# Altium project REMOTER.PrjPCB
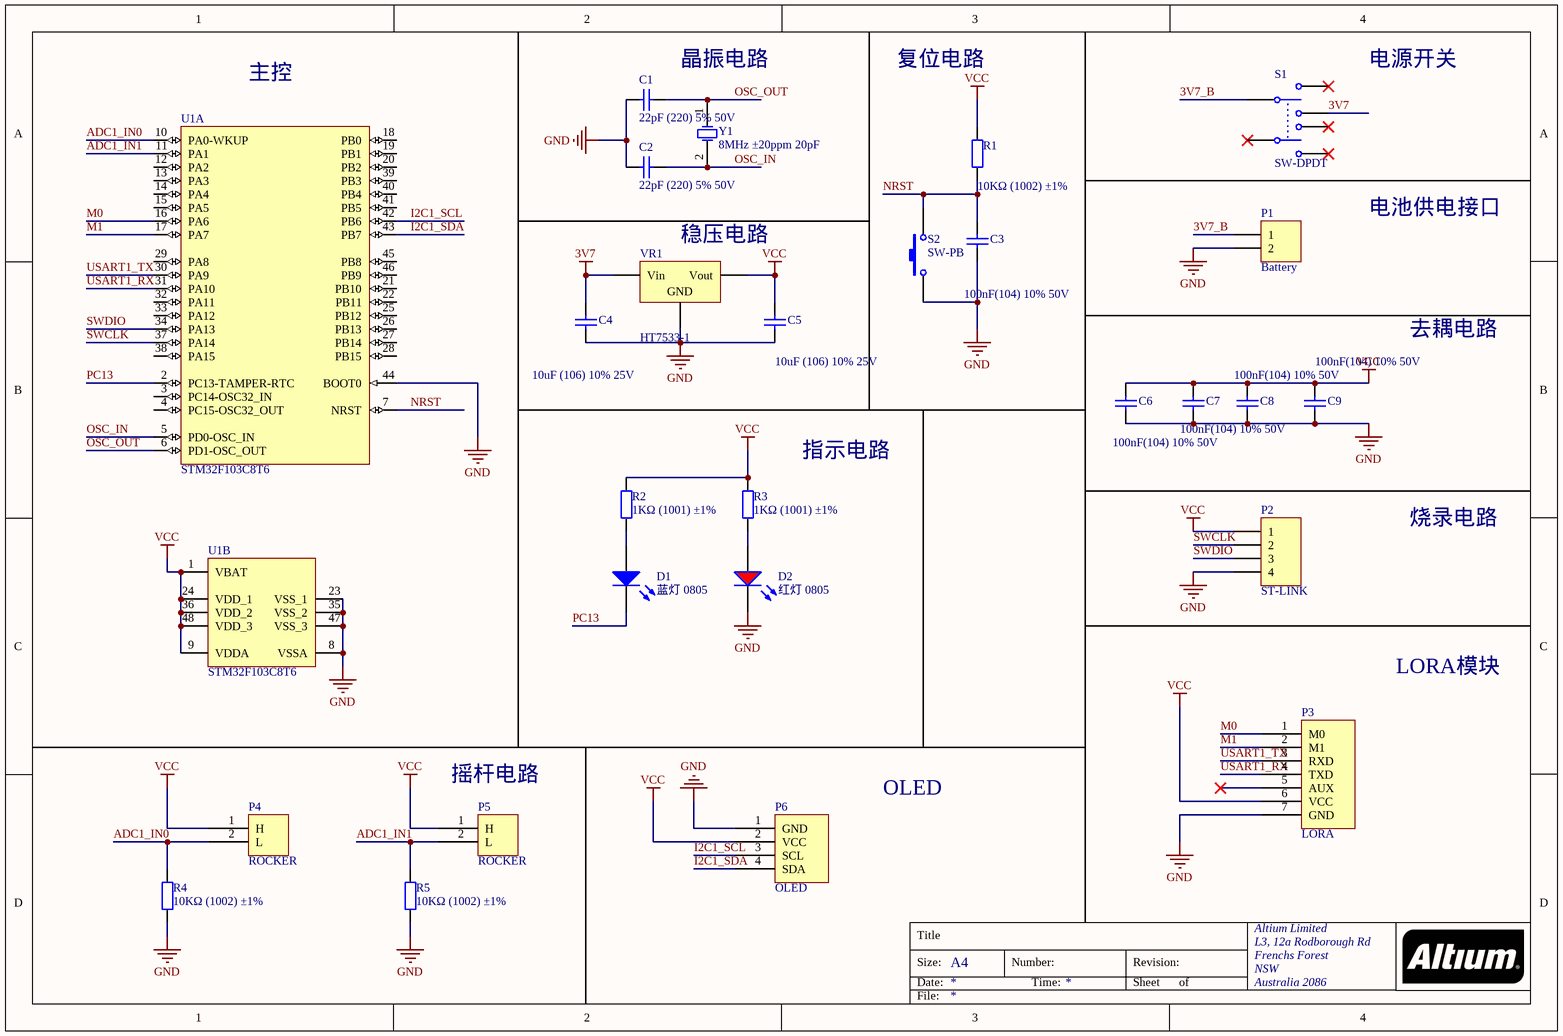
[diagram p0: REMOTER.SchDoc]
1 sheet, 27 parts. Net scope: global (net labels, ports and power ports of the same name join across sheets).
Board file: REMOTER.PcbDoc

## Sheet REMOTER.SchDoc
size A4; Organization: Altium Limited; Address1: L3, 12a Rodborough Rd; Address2: Frenchs Forest; Address3: NSW; Address4: Australia 2086

### Parts
C1  22pF (220) 5% 50V  [0805_C]
C2  22pF (220) 5% 50V  [0805_C]
C3  100nF(104) 10% 50V  [0805_C]
C4  10uF (106) 10% 25V  [0805_C]
C5  10uF (106) 10% 25V  [0805_C]
C6  100nF(104) 10% 50V  [0805_C]
C7  100nF(104) 10% 50V  [0805_C]
C8  100nF(104) 10% 50V  [0805_C]
C9  100nF(104) 10% 50V  [0805_C]
D1  蓝灯 0805  [0805_LED_S1]
D2  红灯 0805  [0805_LED_S1]
P1  Battery  [HDR1X2]
P2  ST-LINK  [HDR1X4]
P3  LORA  [LORA]
P4  ROCKER  [ROCKER]
P5  ROCKER  [ROCKER]
P6  OLED  [OLED]
R1  10KΩ (1002) ±1%  [0805_R]
R2  1KΩ (1001) ±1%  [0805_R]
R3  1KΩ (1001) ±1%  [0805_R]
R4  10KΩ (1002) ±1%  [0805_R]
R5  10KΩ (1002) ±1%  [0805_R]
S1  SW-DPDT  [DPDT-6]
S2  SW-PB  [SPST-2]
U1  STM32F103C8T6  [LQFP-48_7x7x05P]  (parts A,B of 2)
VR1  HT7533-1  [SOT-89(SOT-89-3)]
Y1  8MHz ±20ppm 20pF  [SMD-5032_2P]

### Nets
3V7: C4.2 S1.3 VR1.2(Vin)
GND: C1.1 C2.1 C3.1 C4.1 C5.2 C6.1 C7.1 C8.1 C9.1 D2.K P1.2 P2.4 P3.7(GND) P6.1(GND) R4.1 R5.1 S2.1 U1.8(VSSA) U1.23(VSS_1) U1.35(VSS_2) U1.44(BOOT0) U1.47(VSS_3) VR1.1(GND)
VCC: C5.1 C6.2 C7.2 C8.2 C9.2 P2.1 P3.6(VCC) P4.1(H) P5.1(H) P6.2(VCC) R1.1 R2.1 R3.1 U1.1(VBAT) U1.9(VDDA) U1.24(VDD_1) U1.36(VDD_2) U1.48(VDD_3) VR1.3(Vout)
3V7_B: P1.1 S1.1
ADC1_IN0: P4.2(L) R4.2 U1.10(PA0-WKUP)
ADC1_IN1: P5.2(L) R5.2 U1.11(PA1)
I2C1_SCL: P6.3(SCL) U1.42(PB6)
I2C1_SDA: P6.4(SDA) U1.43(PB7)
M0: P3.1(M0) U1.16(PA6)
M1: P3.2(M1) U1.17(PA7)
NRST: C3.2 R1.2 S2.2 U1.7(NRST)
OSC_IN: C2.2 U1.5(PD0-OSC_IN) Y1.2(OSC2)
OSC_OUT: C1.2 U1.6(PD1-OSC_OUT) Y1.1(OSC1)
PC13: D1.K U1.2(PC13-TAMPER-RTC)
SWCLK: P2.2 U1.37(PA14)
SWDIO: P2.3 U1.34(PA13)
USART1_RX: P3.4(TXD) U1.31(PA10)
USART1_TX: P3.3(RXD) U1.30(PA9)
NetD1_A: D1.A R2.2
NetD2_A: D2.A R3.2

Not connected (* = marked no-connect by the designer): P3 5(AUX)*; S1 2* 4* 5* 6*; U1 3(PC14-OSC32_IN) 4(PC15-OSC32_OUT) 12(PA2) 13(PA3) 14(PA4) 15(PA5) 18(PB0) 19(PB1) 20(PB2) 21(PB10) 22(PB11) 25(PB12) 26(PB13) 27(PB14) 28(PB15) 29(PA8) 32(PA11) 33(PA12) 38(PA15) 39(PB3) 40(PB4) 41(PB5) 45(PB8) 46(PB9)

### Notes on the sheet
- 主控
- 晶振电路
- 复位电路
- 电源开关
- (near VR1) 稳压电路
- 电池供电接口
- 去耦电路
- 指示电路
- 烧录电路
- LORA模块
- (near P5) 摇杆电路
- OLED
- Title
- Size:
- Date:
- A4
- Number:
- Time:
- Revision:
- Sheet
- of
- File:

### Library data of the parts
C1 C2 = 0805 22pF (220) 5% 50V: 贴片电容; ComponentLink1Description: 供应商链接; ComponentLink1URL: http://www.szlcsc.com/product/details_2156.html; Package: 0805; Supplier: LC; SuppliersPartNumber: C1804
C3 C6-C9 = 0805 100nF(104) 10% 50V: 贴片电容; ComponentLink1Description: 供应商链接; ComponentLink1URL: http://www.szlcsc.com/product/details_50686.html; Package: 0805; Supplier: LC; SuppliersPartNumber: C49678
C4 C5 = 0805 10uF (106) 10% 25V: 贴片电容; ComponentLink1Description: 供应商链接; ComponentLink1URL: http://www.szlcsc.com/product/details_16532.html; Package: 0805; Supplier: LC; SuppliersPartNumber: C15850
D1 = 0805 蓝灯: 发光二极管; ComponentLink1Description: 供应商链接; ComponentLink1URL: http://www.szlcsc.com/product/details_2666.html; Package: 0805; Supplier: LC; SuppliersPartNumber: C2293
D2 = 0805 红灯: 发光二极管; ComponentLink1Description: 供应商链接; ComponentLink1URL: http://www.szlcsc.com/product/details_2668.html; Package: 0805; Supplier: LC; SuppliersPartNumber: C2295
P1 = Header 2: Header, 2-Pin; LatestRevisionDate: 17-Jul-2002; LatestRevisionNote: Re-released for DXP Platform.; Publisher: Altium Limited
P2 = Header 4: Header, 4-Pin; LatestRevisionDate: 17-Jul-2002; LatestRevisionNote: Re-released for DXP Platform.; Publisher: Altium Limited
R1 R4 R5 = 0805 10KΩ (1002) 1%: 贴片电阻; ComponentLink1Description: 供应商链接; ComponentLink1URL: http://www.szlcsc.com/product/details_18102.html; Package: 0805; Supplier: LC; SuppliersPartNumber: C17414
R2 R3 = 0805 1KΩ (1001) 1%: 贴片电阻; ComponentLink1Description: 供应商链接; ComponentLink1URL: http://www.szlcsc.com/product/details_18201.html; Package: 0805; Supplier: LC; SuppliersPartNumber: C17513
S1 = SW-DPDT: Double-Pole, Double-Throw Switch; Published: 24-Mar-1999; LatestRevisionDate: 17-Jul-2002; LatestRevisionNote: Re-released for DXP Platform.; PackageReference: DPDT-6; Publisher: Altium Limited; PackageDescription: Switch; 6 Leads
S2 = SW-PB: Switch; Published: 24-Mar-1999; LatestRevisionDate: 17-Jul-2002; LatestRevisionNote: Re-released for DXP Platform.; PackageReference: SPST-2; Publisher: Altium Limited; PackageDescription: Switch; 2 Leads
U1 = STM32F103C8T6: ARM Cortex-M3 32-bit MCU, 64 KB Flash, 20 KB Internal RAM, 37 I/Os, 48-pin LQFP, -40 to 85 degC, Tray; A/D Converter: 2x12-bit (10 Channel); FLASH Size (Prog) (kB): 64; I/Os (High Current): 37; Internal RAM Size (kB): 20; Operating Frequency(F) (Processor speed) (MHz): 72; Supply Voltage(Vcc) min (V): 2; DatasheetVersion: Rev. 16; PackageVersion: Rev. 6, 06/2013; PackageReference: LQFP48; PackageDescription: 48-Pin Low Profile Quad Flat Package, 7 x 7 mm Body, 0.5 mm Pitch; Supplier 1: Digi-Key; Supplier Part Number 1: 497-6063-ND; Supplier 2: Farnell; Supplier Part Number 2: 1447637; Supplier 3: Newark; Supplier Part Number 3: 59M2182; Supplier 4: Newark; Supplier Part Number 4: 57P1222; Supplier 5: Mouser; Supplier Part Number 5: 511-STM32F103C8T6; Core: ARM Cortex-M3; Packing: Tray; Mounting Technology: Surface Mount; PartNumber: STM32F103C8T6; ComponentLink1Description: Manufacturer URL; ComponentLink1URL: http://www.st.com/web/en/home.html; ComponentLink2Description: Datasheet; ComponentLink2URL: http://www.st.com/st-web-ui/static/active/en/resource/technical/document/datasheet/CD00161566.pdf; ComponentLink3Description: Package Specification; ComponentLink3URL: http://www.st.com/st-web-ui/static/active/en/resource/technical/document/datasheet/DM00058181.pdf
VR1 = SOT-89 HT7533-1: 低压差线性稳压(LDO); ComponentLink1Description: 供应商链接; ComponentLink1URL: http://www.szlcsc.com/product/details_14949.html; Package: SOT-89; Supplier: LC; SuppliersPartNumber: C14289
Y1 = SMD-5032_2P 8MHz 20ppm 20pF: 贴片晶振; ComponentLink1Description: 供应商链接; ComponentLink1URL: http://www.szlcsc.com/product/details_117214.html; Package: SMD-5032_2P; Supplier: LC; SuppliersPartNumber: C115962